# EAGLE design RPiOperantPanelBreakout (EAGLE 8.4.1)
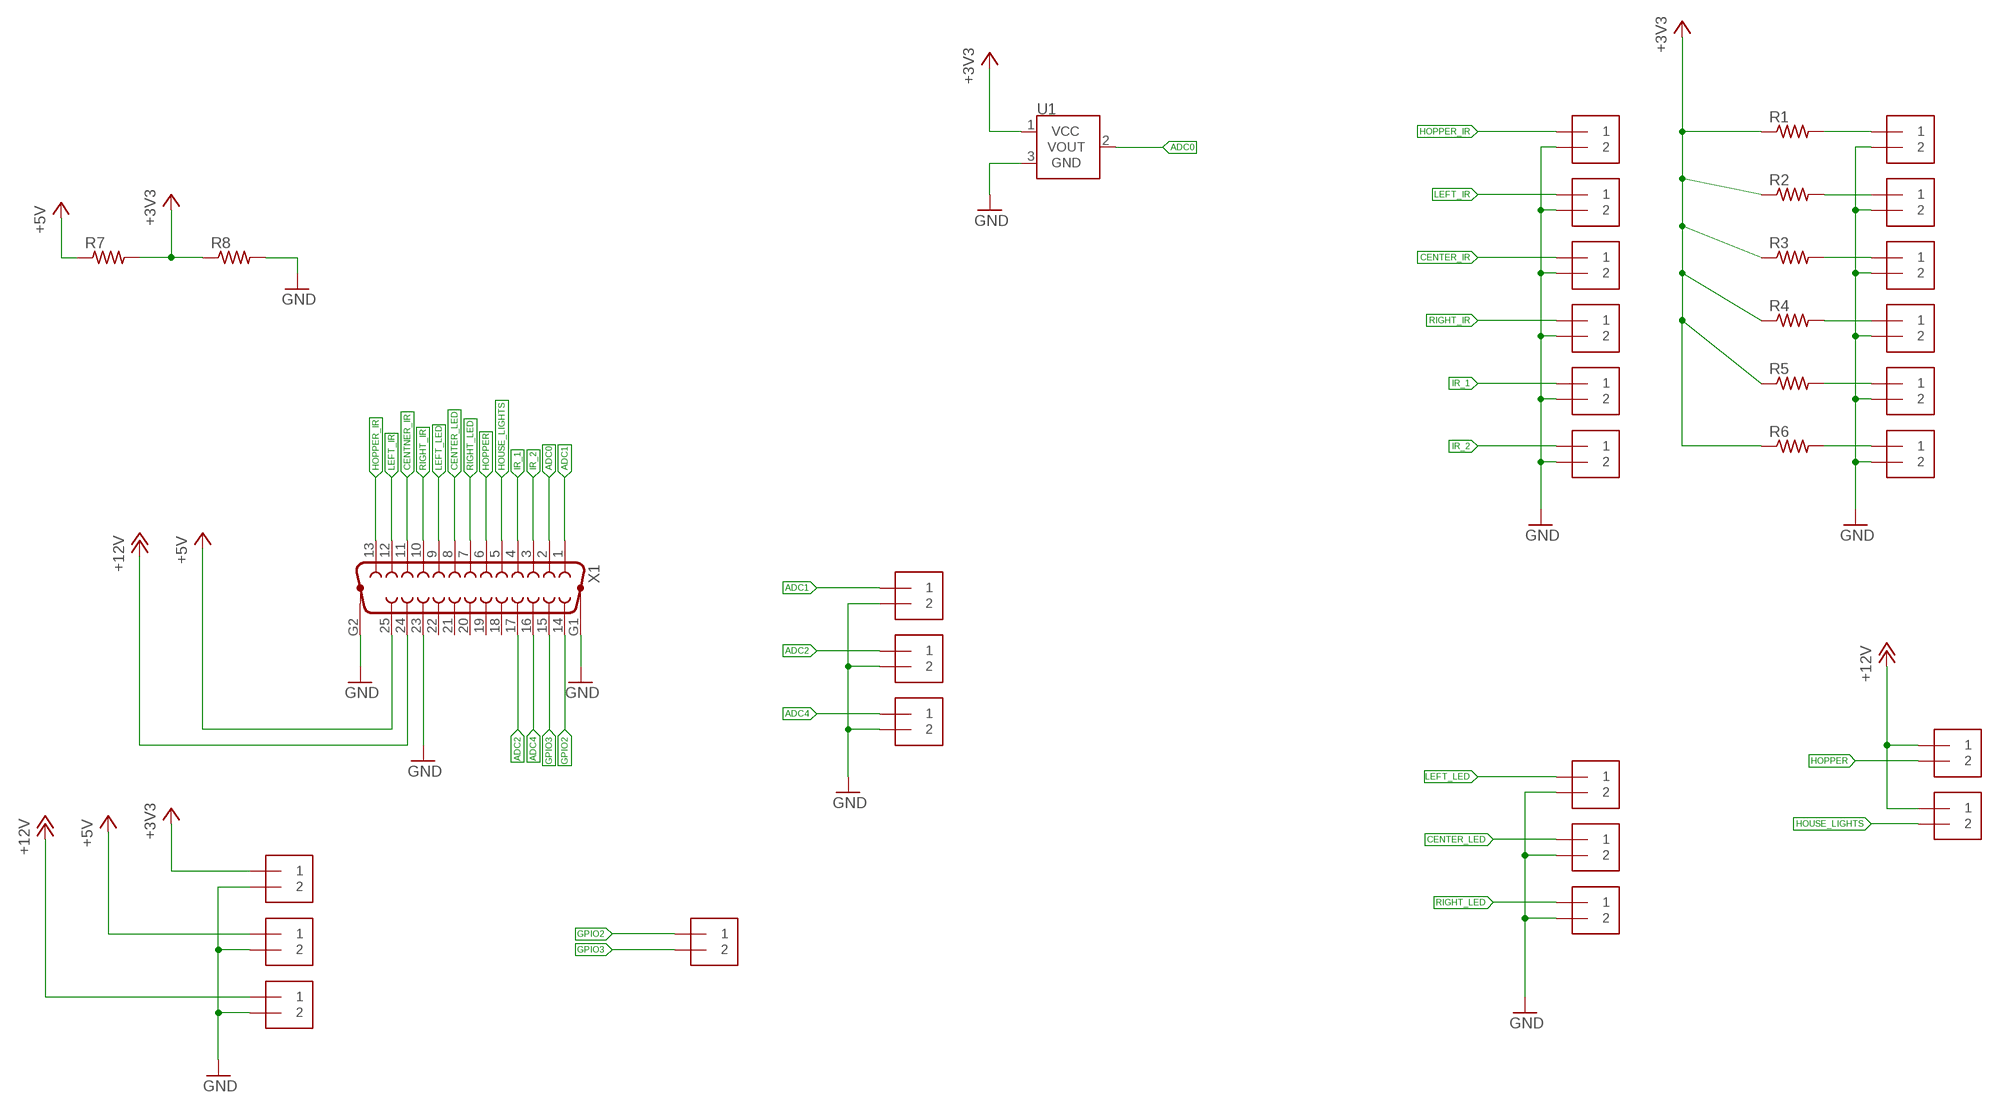
[diagram p0: schematic, sheet 1]

## Parts
J1  1X2-3.5MM  [1X2-3.5MM]
J2  1X2-3.5MM  [1X2-3.5MM]
J3  1X2-3.5MM  [1X2-3.5MM]
J4  1X2-3.5MM  [1X2-3.5MM]
J5  1X2-3.5MM  [1X2-3.5MM]
J6  1X2-3.5MM  [1X2-3.5MM]
J7  1X2-3.5MM  [1X2-3.5MM]
J8  1X2-3.5MM  [1X2-3.5MM]
J9  1X2-3.5MM  [1X2-3.5MM]
J10  1X2-3.5MM  [1X2-3.5MM]
J11  1X2-3.5MM  [1X2-3.5MM]
J12  1X2-3.5MM  [1X2-3.5MM]
J13  1X2-3.5MM  [1X2-3.5MM]
J14  1X2-3.5MM  [1X2-3.5MM]
J15  1X2-3.5MM  [1X2-3.5MM]
J16  1X2-3.5MM  [1X2-3.5MM]
J17  1X2-3.5MM  [1X2-3.5MM]
J18  1X2-3.5MM  [1X2-3.5MM]
J19  1X2-3.5MM  [1X2-3.5MM]
J20  1X2-3.5MM  [1X2-3.5MM]
J21  1X2-3.5MM  [1X2-3.5MM]
J22  1X2-3.5MM  [1X2-3.5MM]
J23  1X2-3.5MM  [1X2-3.5MM]
J24  1X2-3.5MM  [1X2-3.5MM]
R1  R-US_0207/7  [0207/7]
R2  R-US_0207/7  [0207/7]
R3  R-US_0207/7  [0207/7]
R4  R-US_0207/7  [0207/7]
R5  R-US_0207/7  [0207/7]
R6  R-US_0207/7  [0207/7]
R7  R-US_0207/7  [0207/7]
R8  R-US_0207/7  [0207/7]
U1  TMP36GT9  [TO-92]
X1  F25HP  [F25HP]

## Nets
+3V3: J18.1 R1.1 R2.1 R3.1 R4.1 R5.1 R6.1 R7.2 R8.1 U1.1(VCC)
+5V: J19.1 R7.1 X1.25
+12V: J7.1 J8.1 J20.1 X1.24
ADC0: U1.2(VOUT) X1.2
ADC1: J21.1 X1.1
ADC2: J23.1 X1.17
ADC4: J24.1 X1.16
CENTER_IR: J3.1
CENTER_LED: J10.1 X1.8
CENTNER_IR: X1.11
GND: J1.2 J2.2 J3.2 J4.2 J5.2 J6.2 J9.2 J10.2 J11.2 J12.2 J13.2 J14.2 J15.2 J16.2 J17.2 J18.2 J19.2 J20.2 J21.2 J23.2 J24.2 R8.2 U1.3(GND) X1.23 X1.G1 X1.G2
GPIO2: J22.1 X1.14
GPIO3: J22.2 X1.15
HOPPER: J7.2 X1.6
HOPPER_IR: J1.1 X1.13
HOUSE_LIGHTS: J8.2 X1.5
IR_1: J5.1 X1.4
IR_2: J6.1 X1.3
LEFT_IR: J2.1 X1.12
LEFT_LED: J9.1 X1.9
N$1: J13.1 R2.2
N$2: J15.1 R4.2
N$9: J12.1 R1.2
N$11: J14.1 R3.2
N$13: J16.1 R5.2
N$14: J17.1 R6.2
RIGHT_IR: J4.1 X1.10
RIGHT_LED: J11.1 X1.7
Unconnected: X1.18 X1.19 X1.20 X1.21 X1.22

## Library data of the parts
J1-J24 = adafruit:1X2: 3.5mm Terminal block http://www.ladyada.net/library/pcb/eaglelibrary.html
R1-R8 = rcl:R-US_: RESISTOR, American symbol
U1 = SparkFun-Sensors:TMP36: TMP36 Precision Analog °C Temperature Sensor The TMP36 is a low voltage, precision centigrade temperature sensor. It provides a voltage output that is linearly proportional to the Celsius temperature. It also doesn’t require any external calibration to provide typical accuracies of ±1°C at +25°C and ±2°C over the −40°C to +125°C temperature range. We like it because it’s so easy to use: Just give the device a ground and 2.7 to 5.5 VDC and read the voltage on the Vout pin. The output voltage can be converted to temperature easily using the scale factor of 10 mV/°C. Datasheet <http://cdn.sparkfun.com/datasheets/Sensors/Temp/TMP35_36_37.pdf> SparkFun Products Temperature Sensor - TMP36 <https://www.sparkfun.com/products/10988> (SEN-10988) SparkFun Danger Shield <https://www.sparkfun.com/products/11649> (DEV-11649); PROD_ID: IC-09880; SF_ID: SEN-10988
X1 = con-subd:F25HP: SUB-D; OC_FARNELL: unknown; OC_NEWARK: unknown

## Board
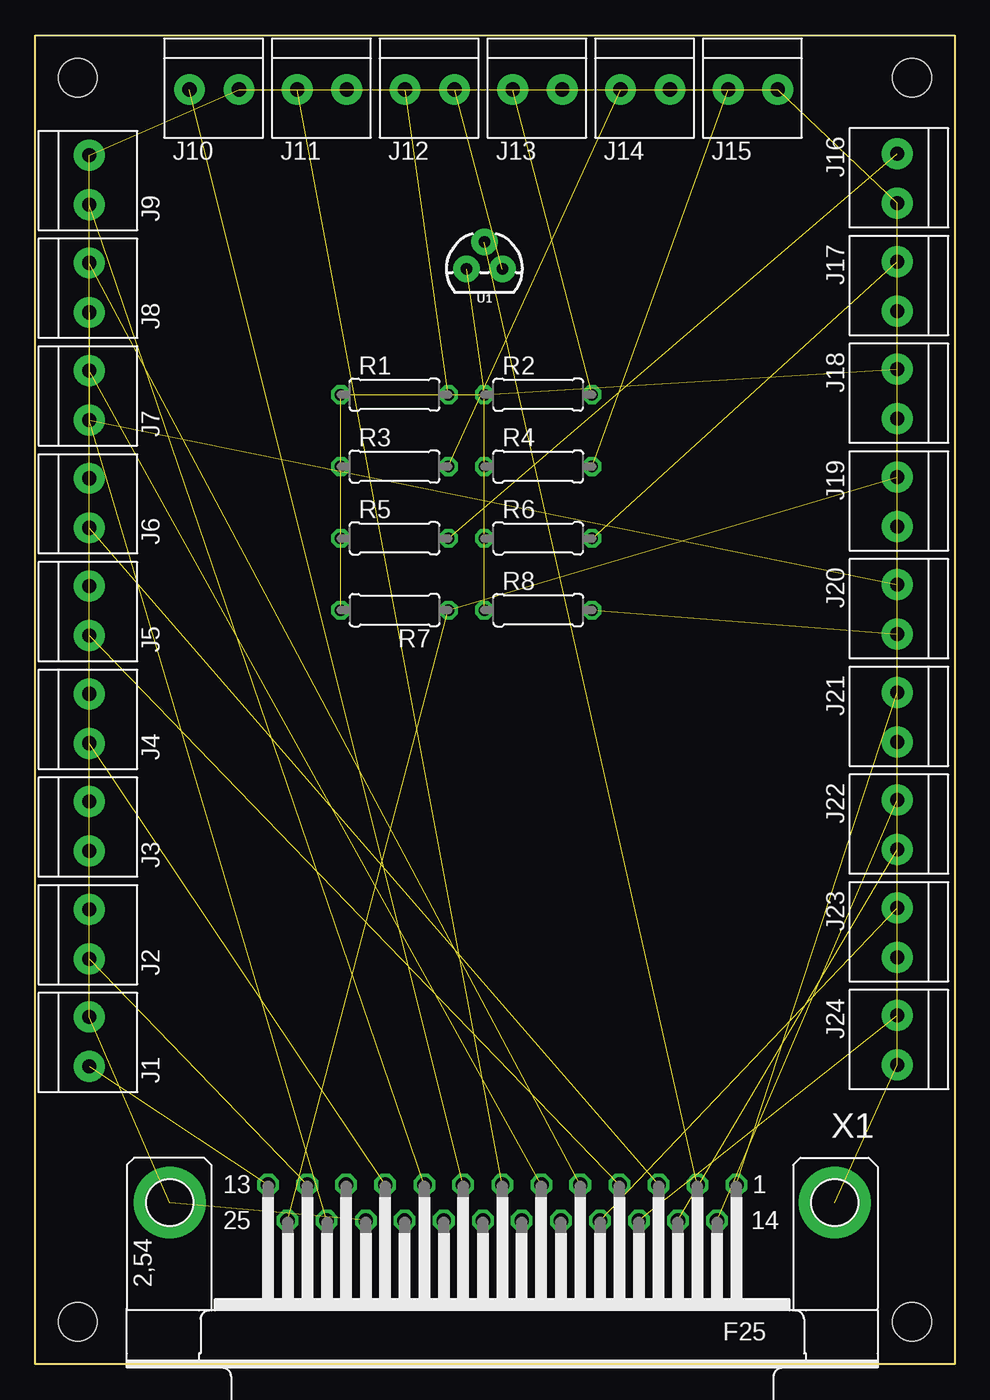
[diagram p1: board, top side]
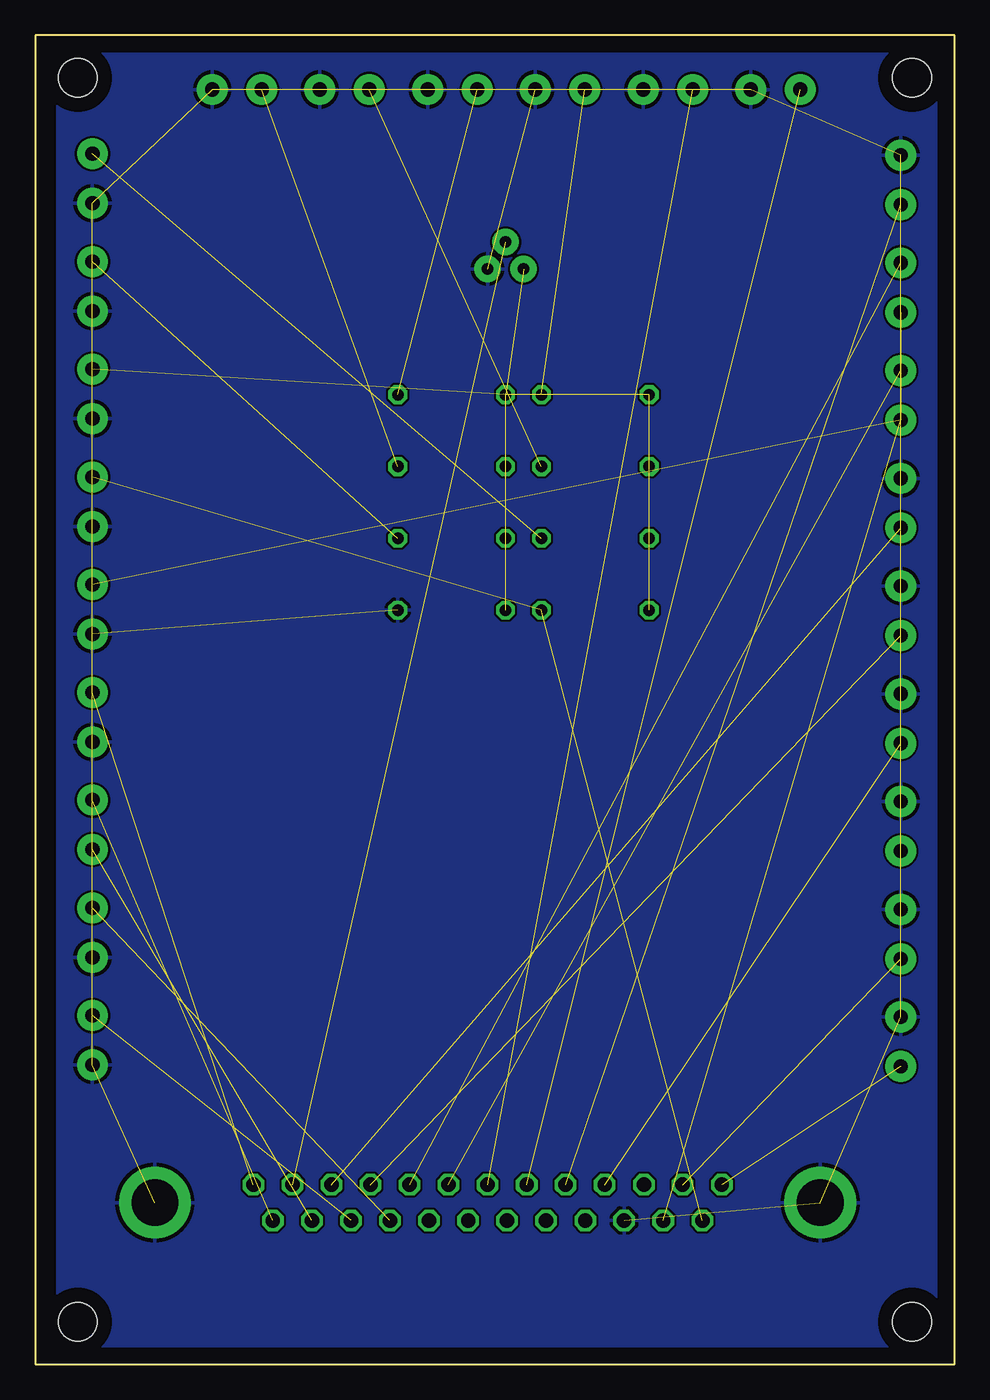
[diagram p2: board, bottom side, seen from below]

Size 65 x 94 mm. Coordinates in mm from the lower left corner, seen from the top.
Outline: 0,93.97 0,0
Outline: 0,0 65,0 65,94 0,94 0,0
Copper layers (1*16): Top 0.035mm / dielectric 1.5mm / Bottom 0.035mm
Design rules "default": minimum track width 6mil, minimum drill 0.35mm, track to track 6mil, track to pad 6mil, pad to pad 6mil, via to via 6mil, smd to smd 6mil, copper to edge 40mil, drill to drill 6mil, minimum pad ring 10mil, minimum via ring 8mil, stop-mask expansion 4mil, vias tented up to drill 0mil, thermal gap 10mil
Holes 2.75 mm at 3,3 62,3 62,91 3,91

### Footprints (pad centres in the part's own frame; a part is rotated, then mirrored left to right if it is on the bottom)
1X2-3.5MM = drill 1 pad 2.184: 1 1.8,0; 2 -1.7,0
0207/7 = drill 0.813 octagon: 1 -3.81,0; 2 3.81,0
TO-92 = drill 0.813 pad 1.88: 1 -1.27,0; 2 0,1.905; 3 1.27,0
F25HP = drill 1.016 octagon: 1 -16.561,-1.27; 2 -13.792,-1.27; 3 -11.049,-1.27; 4 -8.28,-1.27; 5 -5.512,-1.27; 6 -2.769,-1.27; 7 0,-1.27; 8 2.769,-1.27; 9 5.512,-1.27; 10 8.28,-1.27; 11 11.049,-1.27; 12 13.792,-1.27; 13 16.561,-1.27; 14 -15.189,1.27; 15 -12.421,1.27; 16 -9.652,1.27; 17 -6.909,1.27; 18 -4.14,1.27; 19 -1.372,1.27; 20 1.372,1.27; 21 4.14,1.27; 22 6.909,1.27; 23 9.652,1.27; 24 12.421,1.27; 25 15.189,1.27 | drill 3.302 pad 5.08: G1 -23.52,0; G2 23.52,0

### Placement (x,y rotation side)
J1  3.81,22.86 270 top
J2  3.81,30.48 270 top
J3  3.81,38.1 270 top
J4  3.81,45.72 270 top
J5  3.81,53.34 270 top
J6  3.81,60.96 270 top
J7  3.81,68.58 270 top
J8  3.81,76.2 270 top
J9  3.81,83.82 270 top
J10  12.7,90.17 180 top
J11  20.32,90.17 180 top
J12  27.94,90.17 180 top
J13  35.56,90.17 180 top
J14  43.18,90.17 180 top
J15  50.8,90.17 180 top
J16  60.96,83.82 90 top
J17  60.96,76.2 90 top
J18  60.96,68.58 90 top
J19  60.96,60.96 90 top
J20  60.96,53.34 90 top
J21  60.96,45.72 90 top
J22  60.96,38.1 90 top
J23  60.96,30.48 90 top
J24  60.96,22.86 90 top
R1  25.4,68.58 0 top
R2  35.56,68.58 0 top
R3  25.4,63.5 0 top
R4  35.56,63.5 0 top
R5  25.4,58.42 0 top
R6  35.56,58.42 0 top
R7  25.4,53.34 180 top
R8  35.56,53.34 0 top
U1  31.75,77.47 0 top
X1  33.02,11.43 180 top

### Tracks (layer width: path | path; a pad name or v marks a point on that pad's centre or on a via)
+3V3  (9 unrouted)
+5V  (2 unrouted)
+12V  (3 unrouted)
ADC0  (1 unrouted)
ADC1  (1 unrouted)
ADC2  (1 unrouted)
ADC4  (1 unrouted)
CENTER_LED  (1 unrouted)
GND  (25 unrouted)
  pour Bottom: 1.27,1.27 1.27,92.71 63.5,92.71 63.5,1.27
GPIO2  (1 unrouted)
GPIO3  (1 unrouted)
HOPPER  (1 unrouted)
HOPPER_IR  (1 unrouted)
HOUSE_LIGHTS  (1 unrouted)
IR_1  (1 unrouted)
IR_2  (1 unrouted)
LEFT_IR  (1 unrouted)
LEFT_LED  (1 unrouted)
N$1  (1 unrouted)
N$2  (1 unrouted)
N$9  (1 unrouted)
N$11  (1 unrouted)
N$13  (1 unrouted)
N$14  (1 unrouted)
RIGHT_IR  (1 unrouted)
RIGHT_LED  (1 unrouted)